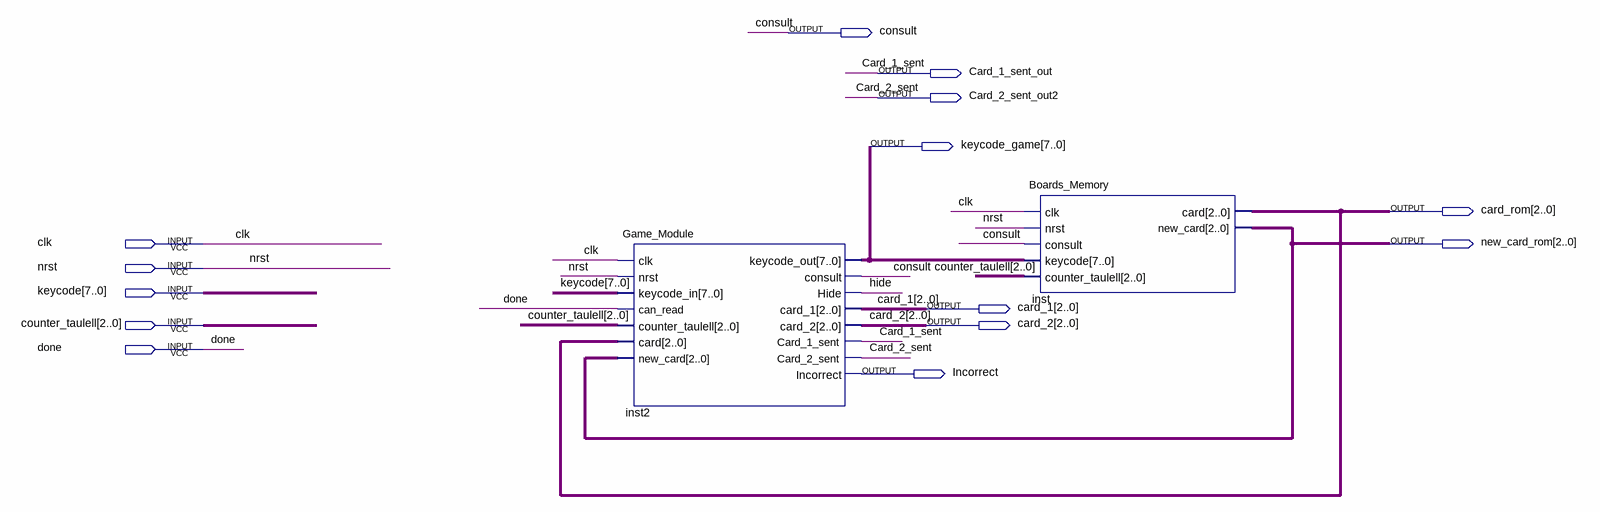
[diagram p0: schematic sheet]
// Quartus schematic sim_game_module_memory.bdf as structural Verilog: 2 symbols, 14 pins
module sim_game_module_memory (
  input  clk,
  input  nrst,
  input  [7:0] keycode,
  input  [2:0] counter_taulell,
  input  done,
  output consult,
  output Card_1_sent_out,
  output Card_2_sent_out2,
  output [7:0] keycode_game,
  output [2:0] card_rom,
  output [2:0] new_card_rom,
  output [2:0] card_1,
  output [2:0] card_2,
  output Incorrect
);

  wire hide;

  Game_Module inst2 (
    .clk(clk), .nrst(nrst), .keycode_in(keycode), .can_read(done), .counter_taulell(counter_taulell),
    .card(card_rom), .new_card(new_card_rom), .keycode_out(keycode_game), .consult(consult), .Hide(hide),
    .card_1(card_1), .card_2(card_2), .Card_1_sent(Card_1_sent_out), .Card_2_sent(Card_2_sent_out2),
    .Incorrect(Incorrect));
  Boards_Memory inst (
    .clk(clk), .nrst(nrst), .consult(consult), .keycode(keycode_game), .counter_taulell(counter_taulell),
    .card(card_rom), .new_card(new_card_rom));

  // Other names for the same wires on the sheet: Card_1_sent = Card_1_sent_out; Card_2_sent = Card_2_sent_out2
endmodule
